# Altium schematic sheet ESP_Grow_Main_V2_2_Con.SchDoc: Connectors
size A; Date: 06/02/2019; Author: Kyle R.; Revision: B; SheetNumber: 1; SheetTotal: 3
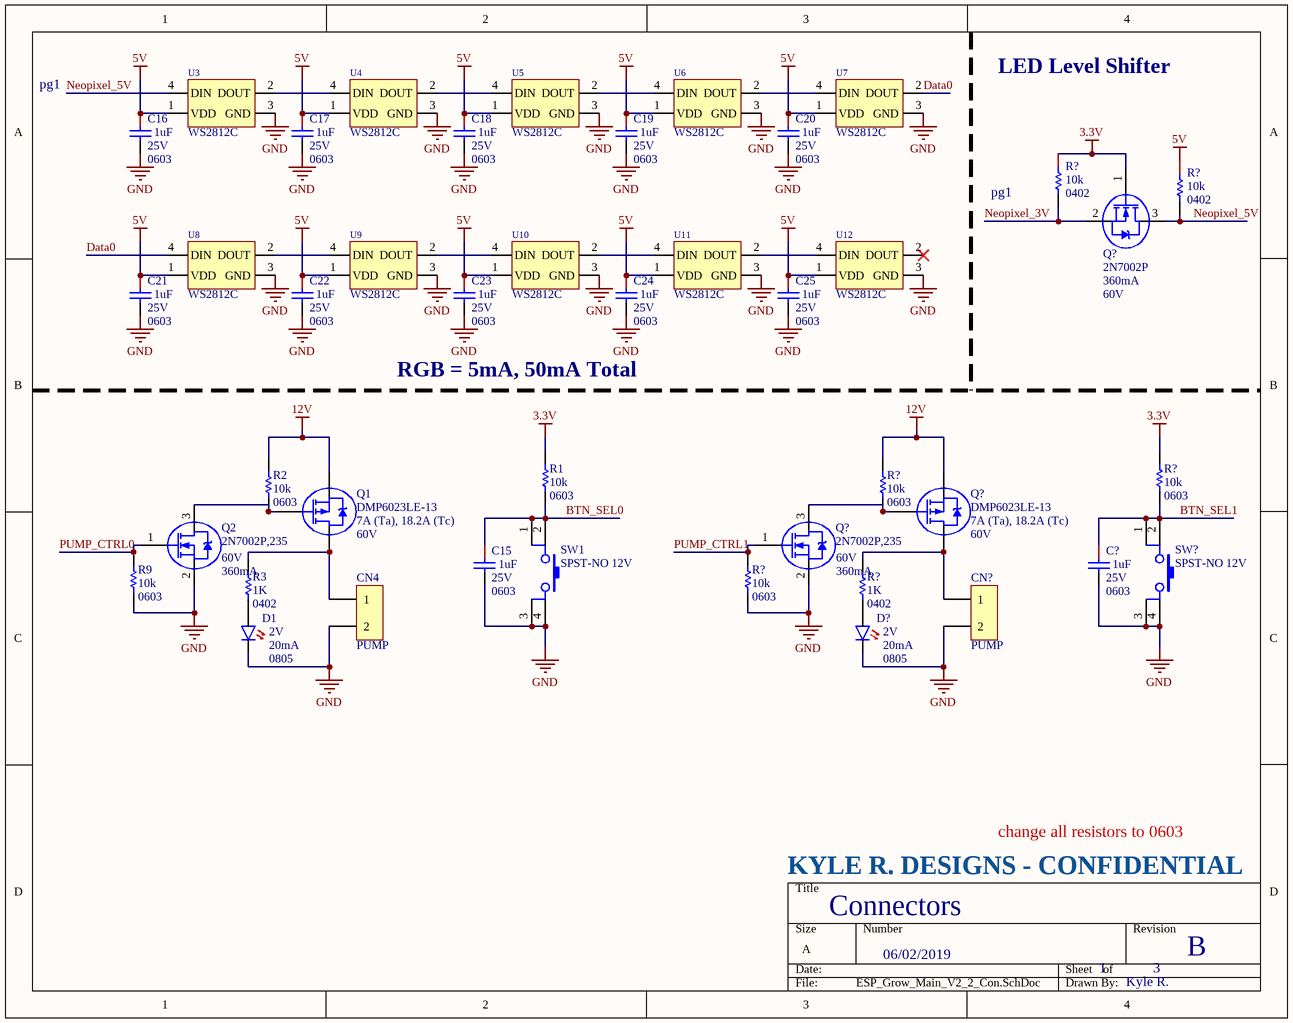
[diagram p0: ESP_Grow_Main_V2_2_Con.SchDoc]

## Parts
(Parts that share a designator on the sheet are numbered #1, #2 ... from top to bottom, then left to right.)
C15  1uF  Voltage - Rated: 25V  Package / Case: 0603  [CAPC0603(1608)_N]
C16  1uF  Voltage - Rated: 25V  Package / Case: 0603  [CAPC0603(1608)_N]
C17  1uF  Voltage - Rated: 25V  Package / Case: 0603  [CAPC0603(1608)_N]
C18  1uF  Voltage - Rated: 25V  Package / Case: 0603  [CAPC0603(1608)_N]
C19  1uF  Voltage - Rated: 25V  Package / Case: 0603  [CAPC0603(1608)_N]
C20  1uF  Voltage - Rated: 25V  Package / Case: 0603  [CAPC0603(1608)_N]
C21  1uF  Voltage - Rated: 25V  Package / Case: 0603  [CAPC0603(1608)_N]
C22  1uF  Voltage - Rated: 25V  Package / Case: 0603  [CAPC0603(1608)_N]
C23  1uF  Voltage - Rated: 25V  Package / Case: 0603  [CAPC0603(1608)_N]
C24  1uF  Voltage - Rated: 25V  Package / Case: 0603  [CAPC0603(1608)_N]
C25  1uF  Voltage - Rated: 25V  Package / Case: 0603  [CAPC0603(1608)_N]
C?  1uF  Voltage - Rated: 25V  Package / Case: 0603  [CAPC0603(1608)_N]
CN4  PUMP  [Molex 1x2 Microfit 3.0]
CN?  PUMP  [Molex 1x2 Microfit 3.0]
D1  Voltage - Forward (Vf) (Typ): 2V  Current - Test: 20mA  Package / Case: 0805  [D/0805]  (hidden comment: D/LEDR/0805)
D?  Voltage - Forward (Vf) (Typ): 2V  Current - Test: 20mA  Package / Case: 0805  [D/0805]  (hidden comment: D/LEDR/0805)
Q1  DMP6023LE-13  Current - Continuous Drain (Id) @ 25°C: 7A (Ta), 18.2A (Tc)  Drain to Source Voltage (Vdss): 60V  [SOT-223 - DMP6023LE]
Q2  2N7002P,235  Continuous Drain Current (ID): 360mA  Drain to Source Breakdown Voltage: 60V  [SOT23-3L]
Q?#1  2N7002P  Continuous Drain Current (ID): 360mA  Drain to Source Voltage (Vdss): 60V  [SOT23]
Q?#2  DMP6023LE-13  Current - Continuous Drain (Id) @ 25°C: 7A (Ta), 18.2A (Tc)  Drain to Source Voltage (Vdss): 60V  [SOT-223 - DMP6023LE]
Q?#3  2N7002P,235  Continuous Drain Current (ID): 360mA  Drain to Source Breakdown Voltage: 60V  [SOT23-3L]
R1  Resistance (Ohms): 10k  Package / Case: 0603  [RESC0603(1608)_N]  (hidden comment: 10K 1%)
R2  Resistance (Ohms): 10k  Package / Case: 0603  [RESC0603(1608)_N]  (hidden comment: 10K 1%)
R3  Package / Case: 0402  [RESC0402(1005)_L]  (hidden comment: 1K)
R9  Resistance (Ohms): 10k  Package / Case: 0603  [RESC0603(1608)_N]  (hidden comment: 10K 1%)
R?#1  Case/Package: 0402  Resistance: 10k  [RESC0402(1005)_N]  (hidden comment: RES 10K OHM 0.1% 1/16W 0402)
R?#2  Case/Package: 0402  Resistance: 10k  [RESC0402(1005)_N]  (hidden comment: RES 10K OHM 0.1% 1/16W 0402)
R?#3  Resistance (Ohms): 10k  Package / Case: 0603  [RESC0603(1608)_N]  (hidden comment: 10K 1%)
R?#4  Resistance (Ohms): 10k  Package / Case: 0603  [RESC0603(1608)_N]  (hidden comment: 10K 1%)
R?#5  Resistance (Ohms): 10k  Package / Case: 0603  [RESC0603(1608)_N]  (hidden comment: 10K 1%)
R?#6  Package / Case: 0402  [RESC0402(1005)_L]  (hidden comment: 1K)
SW1  SPST-NO 12V  [SW TACT Red 6mm x 6mm]
SW?  SPST-NO 12V  [SW TACT Red 6mm x 6mm]
U3  WS2812C  [WS2812C]
U4  WS2812C  [WS2812C]
U5  WS2812C  [WS2812C]
U6  WS2812C  [WS2812C]
U7  WS2812C  [WS2812C]
U8  WS2812C  [WS2812C]
U9  WS2812C  [WS2812C]
U10  WS2812C  [WS2812C]
U11  WS2812C  [WS2812C]
U12  WS2812C  [WS2812C]

## Nets
3.3V: Q?#1.1(G) R1.2 R?#1.1 R?#3.2
5V: C16.1 C17.1 C18.1 C19.1 C20.1 C21.1 C22.1 C23.1 C24.1 C25.1 R?#2.1 U3.1(VDD) U4.1(VDD) U5.1(VDD) U6.1(VDD) U7.1(VDD) U8.1(VDD) U9.1(VDD) U10.1(VDD) U11.1(VDD) U12.1(VDD)
12V: Q1.S Q?#2.S R2.2 R?#4.2
GND: C15.2 C16.2 C17.2 C18.2 C19.2 C20.2 C21.2 C22.2 C23.2 C24.2 C25.2 C?.2 CN4.2 CN?.2 D1.1 D?.1 Q2.2(S) Q?#3.2(S) R9.1 R?#5.1 SW1.3 SW1.4 SW?.3 SW?.4 U3.3(GND) U4.3(GND) U5.3(GND) U6.3(GND) U7.3(GND) U8.3(GND) U9.3(GND) U10.3(GND) U11.3(GND) U12.3(GND)
BTN_SEL0: C15.1 R1.1 SW1.1 SW1.2
BTN_SEL1: C?.1 R?#3.1 SW?.1 SW?.2
Data0: U7.2(DOUT) U8.4(DIN)
Neopixel_3V: Q?#1.2(S) R?#1.2
Neopixel_5V: Q?#1.3(D) R?#2.2 U3.4(DIN)
PUMP_CTRL0: Q2.1(G) R9.2
PUMP_CTRL1: Q?#3.1(G) R?#5.2
NetCN4_1: CN4.1 Q1.D R3.2
NetCN?_1: CN?.1 Q?#2.D R?#6.2
NetD1_2: D1.2 R3.1
NetD?_2: D?.2 R?#6.1
NetQ1_G: Q1.G Q2.3(D) R2.1
NetQ?#2_G: Q?#2.G Q?#3.3(D) R?#4.1
NetU3_2: U3.2(DOUT) U4.4(DIN)
NetU4_2: U4.2(DOUT) U5.4(DIN)
NetU5_2: U5.2(DOUT) U6.4(DIN)
NetU6_2: U6.2(DOUT) U7.4(DIN)
NetU8_2: U8.2(DOUT) U9.4(DIN)
NetU9_2: U9.2(DOUT) U10.4(DIN)
NetU10_2: U10.2(DOUT) U11.4(DIN)
NetU11_2: U11.2(DOUT) U12.4(DIN)

Not connected (* = marked no-connect by the designer): U12 2(DOUT)*

## Notes on the sheet
- pg1
- LED Level Shifter
- (near R?#1) pg1
- RGB = 5mA, 50mA Total
- change all resistors to 0603
- KYLE R. DESIGNS - CONFIDENTIAL

## Library data of the parts
C15-C25 C? = CAP CER 1UF 25V 10% X7R 0603: 1uF 0603 25V; Manufacturer: TDK Corporation; Manufacturer Part Number: CGA3E1X7R1E105K080AC; Tolerance: ±10%; Temperature Coefficient: X7R; Supplier 1: Digi-Key; RoHS: RoHS Compliant; Category: Capacitors; Stock 1: 360610; Pricing 1: 1=0.2, 10=0.135, 100=0.0686, 500=0.04696, 1000=0.04154 (USD); Packaging: Cut Tape (CT); Part Status: Active; Operating Temperature: -55°C ~ 125°C; Features: -; Ratings: AEC-Q200; Applications: Automotive; Failure Rate: -; Mounting Type: Surface Mount, MLCC; Size / Dimension: 0.063" L x 0.032" W (1.60mm x 0.80mm); Height - Seated (Max): -; Thickness (Max): 0.035" (0.90mm); Lead Spacing: -; Lead Style: -; ComponentLink1URL: https://product.tdk.com/info/en/catalog/datasheets/mlcc_automotive_general_en.pdf; ComponentLink1Description: https://product.tdk.com/info/en/catalog/datasheets/mlcc_automotive_general_en.pdf; Supplier Part Number 1: 445-6931-1-ND
CN4 CN? = MICROFIT 3.0 HDR VERT CPI 2CKT: Molex Microfit 1x2 Vert Header; Manufacturer: Molex, LLC; Manufacturer Part Number: 0430450227; Shrouding: Shrouded - 4 Wall; Number of Positions: 2; Number of Positions Loaded: All; Row Spacing: 0.118" (3.00mm); Supplier 1: Digi-Key; RoHS: RoHS Compliant; Category: Connectors, Interconnects; Stock 1: 4002; Pricing 1: 1=0.8, 10=0.705, 50=0.636, 100=0.6083, 250=0.553, 500=0.4977, 1000=0.4424, 2500=0.40092, 5000=0.3871 (USD); Packaging: Tray; Part Status: Active; Connector Type: Header; Contact Type: Male Pin; Pitch: -; Number of Rows: 2; Mounting Type: Through Hole; Termination: Solder; Fastening Type: Locking Ramp; Contact Mating Length: -; Features: Board Guide; Contact Finish: Tin; Contact Finish Thickness: 60µin (1.52µm); Color: Black; ComponentLink1URL: http://www.molex.com/pdm_docs/sd/430450227_sd.pdf; ComponentLink1Description: http://www.molex.com/pdm_docs/sd/430450227_sd.pdf; Supplier Part Number 1: WM10657-ND
D1 D? = D/LEDR/0805: Red 625nm LED Indication - Discrete 2V 0805; Digikey Part: 732-4984-1-ND; Cost: 0.23; Supplier 1: Digi-Key; Supplier Part Number 1: 732-4984-6-ND
Q1 Q?#2 = DMP6023LE-13: MOSFET P-CH 60V 7A SOT223; Manufacturer: Diodes Incorporated; FET Type: P-Channel; Drive Voltage (Max Rds On,  Min Rds On): 4.5V, 10V; Vgs(th) (Max) @ Id: 3V @ 250µA; Vgs (Max): ±20V; Power Dissipation (Max): 2W (Ta); Rds On (Max) @ Id, Vgs: 28 mOhm @ 5A, 10V; Supplier 1: Digi-Key; Manufacturer Part Number: DMP6023LE-13; RoHS: RoHS Compliant; Category: Discrete Semiconductor Products; Stock 1: 16540; Pricing 1: 1=0.95, 10=0.829, 100=0.6396, 500=0.4738, 1000=0.37904 (USD); Packaging: Cut Tape (CT); Part Status: Active; Technology: MOSFET (Metal Oxide); FET Feature: -; Operating Temperature: -55°C ~ 150°C (TJ); Mounting Type: Surface Mount; Supplier Device Package: SOT-223; Package / Case: TO-261-4, TO-261AA; ComponentLink1URL: https://www.diodes.com/assets/Datasheets/DMP6023LE.pdf; ComponentLink1Description: https://www.diodes.com/assets/Datasheets/DMP6023LE.pdf; Supplier Part Number 1: DMP6023LE-13DICT-ND
Q2 Q?#3 = 2N7002P,235: MOSFET N-CH 60V 0.36A SOT-23; Manufacturer: NXP Semiconductors; Rds On Max: 1.6R; Input Capacitance: 50pF; Rise Time: 4ns; Power Dissipation: 420mW; Max Power Dissipation: 350mW; Number of Elements: 1; Turn-On Delay Time: 3ns; Turn-Off Delay Time: 10ns; Fall Time: 5ns; Gate to Source Voltage (Vgs): 20V; FET Type: N-Channel; Current - Continuous Drain (Id) @ 25°C: 360mA (Ta); Drive Voltage (Max Rds On,  Min Rds On): 10V; Vgs(th) (Max) @ Id: 2.4V @ 250µA; Vgs (Max): ±20V; Power Dissipation (Max): 350mW (Ta); Rds On (Max) @ Id, Vgs: 1.6 Ohm @ 500mA, 10V; ComponentLink1URL: http://assets.nexperia.com/documents/data-sheet/2N7002P.pdf; ComponentLink1Description: http://assets.nexperia.com/documents/data-sheet/2N7002P.pdf; ComponentLink2URL: https://datasheet.ciiva.com/4439/2n7002p-99415-4439248.pdf; ComponentLink2Description: https://datasheet.ciiva.com/4439/2n7002p-99415-4439248.pdf; ComponentLink3URL: https://datasheet.ciiva.com/6371/2n7002p-6371141.pdf; ComponentLink3Description: https://datasheet.ciiva.com/6371/2n7002p-6371141.pdf; ComponentLink4URL: https://datasheet.ciiva.com/49067/getdatasheetpartid-765733-49067862.pdf; ComponentLink4Description: https://datasheet.ciiva.com/49067/getdatasheetpartid-765733-49067862.pdf; ComponentLink5URL: https://datasheet.ciiva.com/11168/2n7002p-11168552.pdf; ComponentLink5Description: https://datasheet.ciiva.com/11168/2n7002p-11168552.pdf; ComponentLink6URL: https://datasheet.ciiva.com/26921/getdatasheetpartid-765733-26921227.pdf; ComponentLink6Description: https://datasheet.ciiva.com/26921/getdatasheetpartid-765733-26921227.pdf; ComponentLink7URL: https://datasheet.ciiva.com/15216/getdatasheetpartid-496132-15216636.pdf; ComponentLink7Description: https://datasheet.ciiva.com/15216/getdatasheetpartid-496132-15216636.pdf; ComponentLink8URL: https://datasheet.ciiva.com/46633/discretesemiconductors-46633181.pdf; ComponentLink8Description: https://datasheet.ciiva.com/46633/discretesemiconductors-46633181.pdf; Supplier 1: Digi-Key; Supplier Part Number 1: 568-11588-1-ND; Manufacturer Part Number: 2N7002P,235; Stock 1: 109268; Pricing 1: 1=0.14, 10=0.128, 100=0.07, 500=0.043, 1000=0.0294 (USD); Case/Package: SOT; Number of Pins: 3; Contact Plating: Tin; Min Operating Temperature: -55°C; Max Operating Temperature: 150°C; Package Quantity: 10000; Packaging: Tape and Reel; Max Dual Supply Voltage: 60V; Drain to Source Voltage (Vdss): 60V; Drain to Source Resistance: 1.6R; Radiation Hardening: No; Lead Free: Lead Free; Supplier 2: Digi-Key; RoHS: RoHS Compliant; Category: Discrete Semiconductor Products; Stock 2: 177811; Pricing 2: 1=0.16, 10=0.148, 100=0.0969, 500=0.04738, 1000=0.03231 (USD); Part Status: Active; Technology: MOSFET (Metal Oxide); FET Feature: -; Operating Temperature: -55°C ~ 150°C (TJ); Mounting Type: Surface Mount; Supplier Device Package: TO-236AB (SOT23); Package / Case: TO-236-3, SC-59, SOT-23-3; ComponentLink9URL: https://assets.nexperia.com/documents/data-sheet/2N7002P.pdf; ComponentLink9Description: https://assets.nexperia.com/documents/data-sheet/2N7002P.pdf; Supplier Part Number 2: 1727-1865-1-ND
Q?#1 = CMP-012-0002-05: MOSFET N-CH 60V 0.36A SOT-23; Drain to Source Resistance: 1.6R; Gate to Source Voltage (Vgs): 20V; Turn-Off Delay Time: 10ns; Input Capacitance: 50pF; Max Power Dissipation: 350mW; Rise Time: 4ns; Fall Time: 5ns; Number of Elements: 1; Power Dissipation: 420mW; Turn-On Delay Time: 3ns; Contact Plating: Tin; Case/Package: SOT; Number of Pins: 3; Rds On Max: 1.6R; Package Quantity: 10000; Lead Free: Lead Free; Packaging: Tape and Reel; Max Dual Supply Voltage: 60V; Min Operating Temperature: -55°C; Radiation Hardening: No; Drain to Source Breakdown Voltage: 60V; Max Operating Temperature: 150°C
R1 R2 R9 R?#3-R?#5 = RES 10K OHM 1/10W 1% 0603 SMD: 10K 0603; Manufacturer: Panasonic Electronic Components; Manufacturer Part Number: ERJ-3EKF1002V; Power (Watts): 0.1W, 1/10W; Temperature Coefficient: ±100ppm/°C; Category: Resistors; Supplier 1: Digi-Key; RoHS: RoHS Compliant; Stock 1: 5046430; Pricing 1: 1=0.1, 50=0.015, 100=0.0114, 250=0.00844, 500=0.00624, 1000=0.00416, 2500=0.00351 (USD); Packaging: Cut Tape (CT); Tolerance: ±1%; Composition: Thick Film; Features: -; Supplier Device Package: 0603; Size / Dimension: 0.063" L x 0.031" W (1.60mm x 0.80mm); Height: 0.022" (0.55mm); Number of Terminations: 2; ComponentLink1URL: http://industrial.panasonic.com/www-cgi/jvcr13pz.cgi?E+PZ+3+AOA0002+ERJ3EKF1002V+7+WW; ComponentLink1Description: http://industrial.panasonic.com/www-cgi/jvcr13pz.cgi?E+PZ+3+AOA0002+ERJ3EKF1002V+7+WW; Supplier Part Number 1: P10.0KHCT-ND
R3 R?#6 = RES 1K OHM 1% 1/16W 0402: 1K 0402; Manufacturer: Yageo; Manufacturer Part Number: RC0402FR-071KL; Tolerance: 1%; Temperature Coefficient: 100ppm/°C; Power Rating: 62.5mW; Voltage Rating: 50V; ComponentLink1URL: https://datasheet.ciiva.com/2453/pyu-r-int-thick-7-2453361.pdf; ComponentLink1Description: https://datasheet.ciiva.com/2453/pyu-r-int-thick-7-2453361.pdf; ComponentLink2URL: https://datasheet.ciiva.com/2453/pyu-r-int-thick-7-2453362.pdf; ComponentLink2Description: https://datasheet.ciiva.com/2453/pyu-r-int-thick-7-2453362.pdf; ComponentLink3URL: https://datasheet.ciiva.com/2453/pyu-r-int-thick-7-2453363.pdf; ComponentLink3Description: https://datasheet.ciiva.com/2453/pyu-r-int-thick-7-2453363.pdf; ComponentLink4URL: https://datasheet.ciiva.com/22747/1018594-22747509.pdf; ComponentLink4Description: https://datasheet.ciiva.com/22747/1018594-22747509.pdf; ComponentLink5URL: https://datasheet.ciiva.com/15189/getdatasheetpartid-323696-15189334.pdf; ComponentLink5Description: https://datasheet.ciiva.com/15189/getdatasheetpartid-323696-15189334.pdf; ComponentLink6URL: https://datasheet.ciiva.com/16740/pyu-rc0402-51-rohs-l-6-r-16740567.pdf; ComponentLink6Description: https://datasheet.ciiva.com/16740/pyu-rc0402-51-rohs-l-6-r-16740567.pdf; ComponentLink7URL: https://datasheet.ciiva.com/12667/pyu-rc0402-51-rohs-l-6-r-12667930.pdf; ComponentLink7Description: https://datasheet.ciiva.com/12667/pyu-rc0402-51-rohs-l-6-r-12667930.pdf; ComponentLink8URL: https://datasheet.ciiva.com/11819/0900766b80c66297-11819452.pdf; ComponentLink8Description: https://datasheet.ciiva.com/11819/0900766b80c66297-11819452.pdf; Supplier 1: Digi-Key; Supplier Part Number 1: 311-1.00KLRCT-ND; Stock 1: 21888659; Pricing 1: 1=0.1, 10=0.014, 100=0.0056, 1000=0.0025, 2500=0.0022, 5000=0.0018 (USD); Case/Package: 0402; Number of Pins: 2; Case Code (Imperial): 0402; Case Code (Metric): 1005; Min Operating Temperature: -55°C; Max Operating Temperature: 155°C; Packaging: Tape and Reel; Composition: Thick Film; Voltage Rating (DC): 50V; Termination: SMD/SMT; Military Standard: Not; Length: 1mm; Height: 0.32mm; Width: 0.5mm; Depth: 0.5mm; REACH SVHC: Unknown; Lead Free: Lead Free; ComponentLink9URL: https://datasheet.ciiva.com/11819/0900766b80c66297-11819477.pdf; ComponentLink9Description: https://datasheet.ciiva.com/11819/0900766b80c66297-11819477.pdf; ComponentLink10URL: https://datasheet.ciiva.com/12666/pyu-rc0402-51-rohs-l-6-r-12666741.pdf; ComponentLink10Description: https://datasheet.ciiva.com/12666/pyu-rc0402-51-rohs-l-6-r-12666741.pdf; ComponentLink11URL: https://datasheet.ciiva.com/17063/pyu-rc0402-51-rohs-l-6-r-17063193.pdf; ComponentLink11Description: https://datasheet.ciiva.com/17063/pyu-rc0402-51-rohs-l-6-r-17063193.pdf; ComponentLink12URL: https://datasheet.ciiva.com/22747/1018594-22747513.pdf; ComponentLink12Description: https://datasheet.ciiva.com/22747/1018594-22747513.pdf; ComponentLink13URL: https://datasheet.ciiva.com/7849/1018594-7849869.pdf; ComponentLink13Description: https://datasheet.ciiva.com/7849/1018594-7849869.pdf; ComponentLink14URL: https://datasheet.ciiva.com/7983/1018594-7983502.pdf; ComponentLink14Description: https://datasheet.ciiva.com/7983/1018594-7983502.pdf; ComponentLink15URL: https://datasheet.ciiva.com/7849/1018594-7849871.pdf; ComponentLink15Description: https://datasheet.ciiva.com/7849/1018594-7849871.pdf; Category: Resistors; Resistance: 1K
R?#1 R?#2 = CMP-001-0950-02: 10 kOhms ±0.1% 0.063W, 1/16W Chip Resistor 0402 (1005 Metric) Automotive AEC-Q200 Thin Film; Temperature Coefficient: 25ppm/°C; Max Power Dissipation: 63mW; Length: 0.039inch; Max Operating Temperature: 155°C; Min Operating Temperature: -55°C; Packaging: Tape and Reel; Tolerance: 0.1%; Width: 0.02inch; Case Code (Imperial): 0402; Contact Plating: Tin,Matte; Height: 0.016inch; Composition: Thin Film; Case Code (Metric): 1005; Package Quantity: 10000; Mount: Surface Mount; Radiation Hardening: No; Number of Terminations: 2; Features: Moisture Resistant
SW1 SW? = PTS645SM43SMTR92 LFS: SWITCH TACTILE SPST-NO 0.05A 12V; Manufacturer: C&K; Switch Function: Off-Mom; Contact Rating @ Voltage: 0.05A @ 12VDC; Actuator Type: Standard; Actuator Height off PCB, Vertical: 4.30mm; Actuator Orientation: Top Actuated; Outline: 6.00mm x 6.00mm; Illumination: Non-Illuminated; Operating Force: 160gf; Actuator Material: Polyamide (PA66), Nylon 6/6; Mechanical Life: 100,000 Cycles; ClassName: *; Supplier 1: Digi-Key; Manufacturer Part Number: PTS645SM43SMTR92 LFS; RoHS: RoHS Compliant; Category: Switches; Stock 1: 234699; Pricing 1: 1=0.15, 10=0.147, 25=0.1416, 50=0.1366, 100=0.129, 250=0.12144, 500=0.11638 (USD); Packaging: Cut Tape (CT); Part Status: Active; Circuit: SPST-NO; Mounting Type: Surface Mount; Actuator Length, Right Angle: -; Termination Style: Gull Wing; Illumination Type, Color: -; Illumination Voltage (Nominal): -; Ingress Protection: -; Features: Blue Actuator; Switch Travel: -; Operating Temperature: -20°C ~ 60°C; ComponentLink1URL: http://www.ckswitches.com/media/1471/pts645.pdf; ComponentLink1Description: http://www.ckswitches.com/media/1471/pts645.pdf; Supplier Part Number 1: CKN9112CT-ND
U3-U12 = WS2812C: Serial RGB LED; RGB Current: 5mA; Voltage: 3.5V ~ 5.3V; RED Brightness: 60mcd; GREEN Brightness: 245mcd; BLUE Brightness: 65 mcd; White Brightness: 365 mcd; LCSC: C114587; Datasheet: https://datasheet.lcsc.com/szlcsc/Worldsemi-WS2812C_C114587.pdfhttps://datasheet.lcsc.com/szlcsc/Worldsemi-WS2812C_C114587.pdf